# Altium schematic sheet UNG_8088_EVB_LAN9252-SPI_LAN9252-2.SchDoc
size 416 x 264 mm; Revision: A0; SheetNumber: 4; SheetTotal: 4; PageSetup: Record=PageOptions|CenterHorizontal=True|CenterVertical=True|PrintScale=1.02|XCorrection=1.00|YCorrection=1.00|PrintKind=0|BorderSize=5000000|LeftOffset=0|BottomOffset=0|Orientation=2|PaperLength=1000|PaperWidth=1000|Scale=100|PaperSource=15|PrintQuality=-3|MediaType=1|DitherType=10|PrintScaleMode=1|PaperKind=11 x 17|PaperIndex=119; SheetTitle: Change Log; PageTitle: LAN9252-2; ProjName: JUTLAND; DesignDescription: EVB_LAN9252-SPI; Designer: Manikandan; PartNumber: UNG_8088; DocumentFullPathAndName: //depot_np_hweng_boards/ung_hweng/UNG_8088_FDB_LAN9252-ADD-ON-forF28379D/
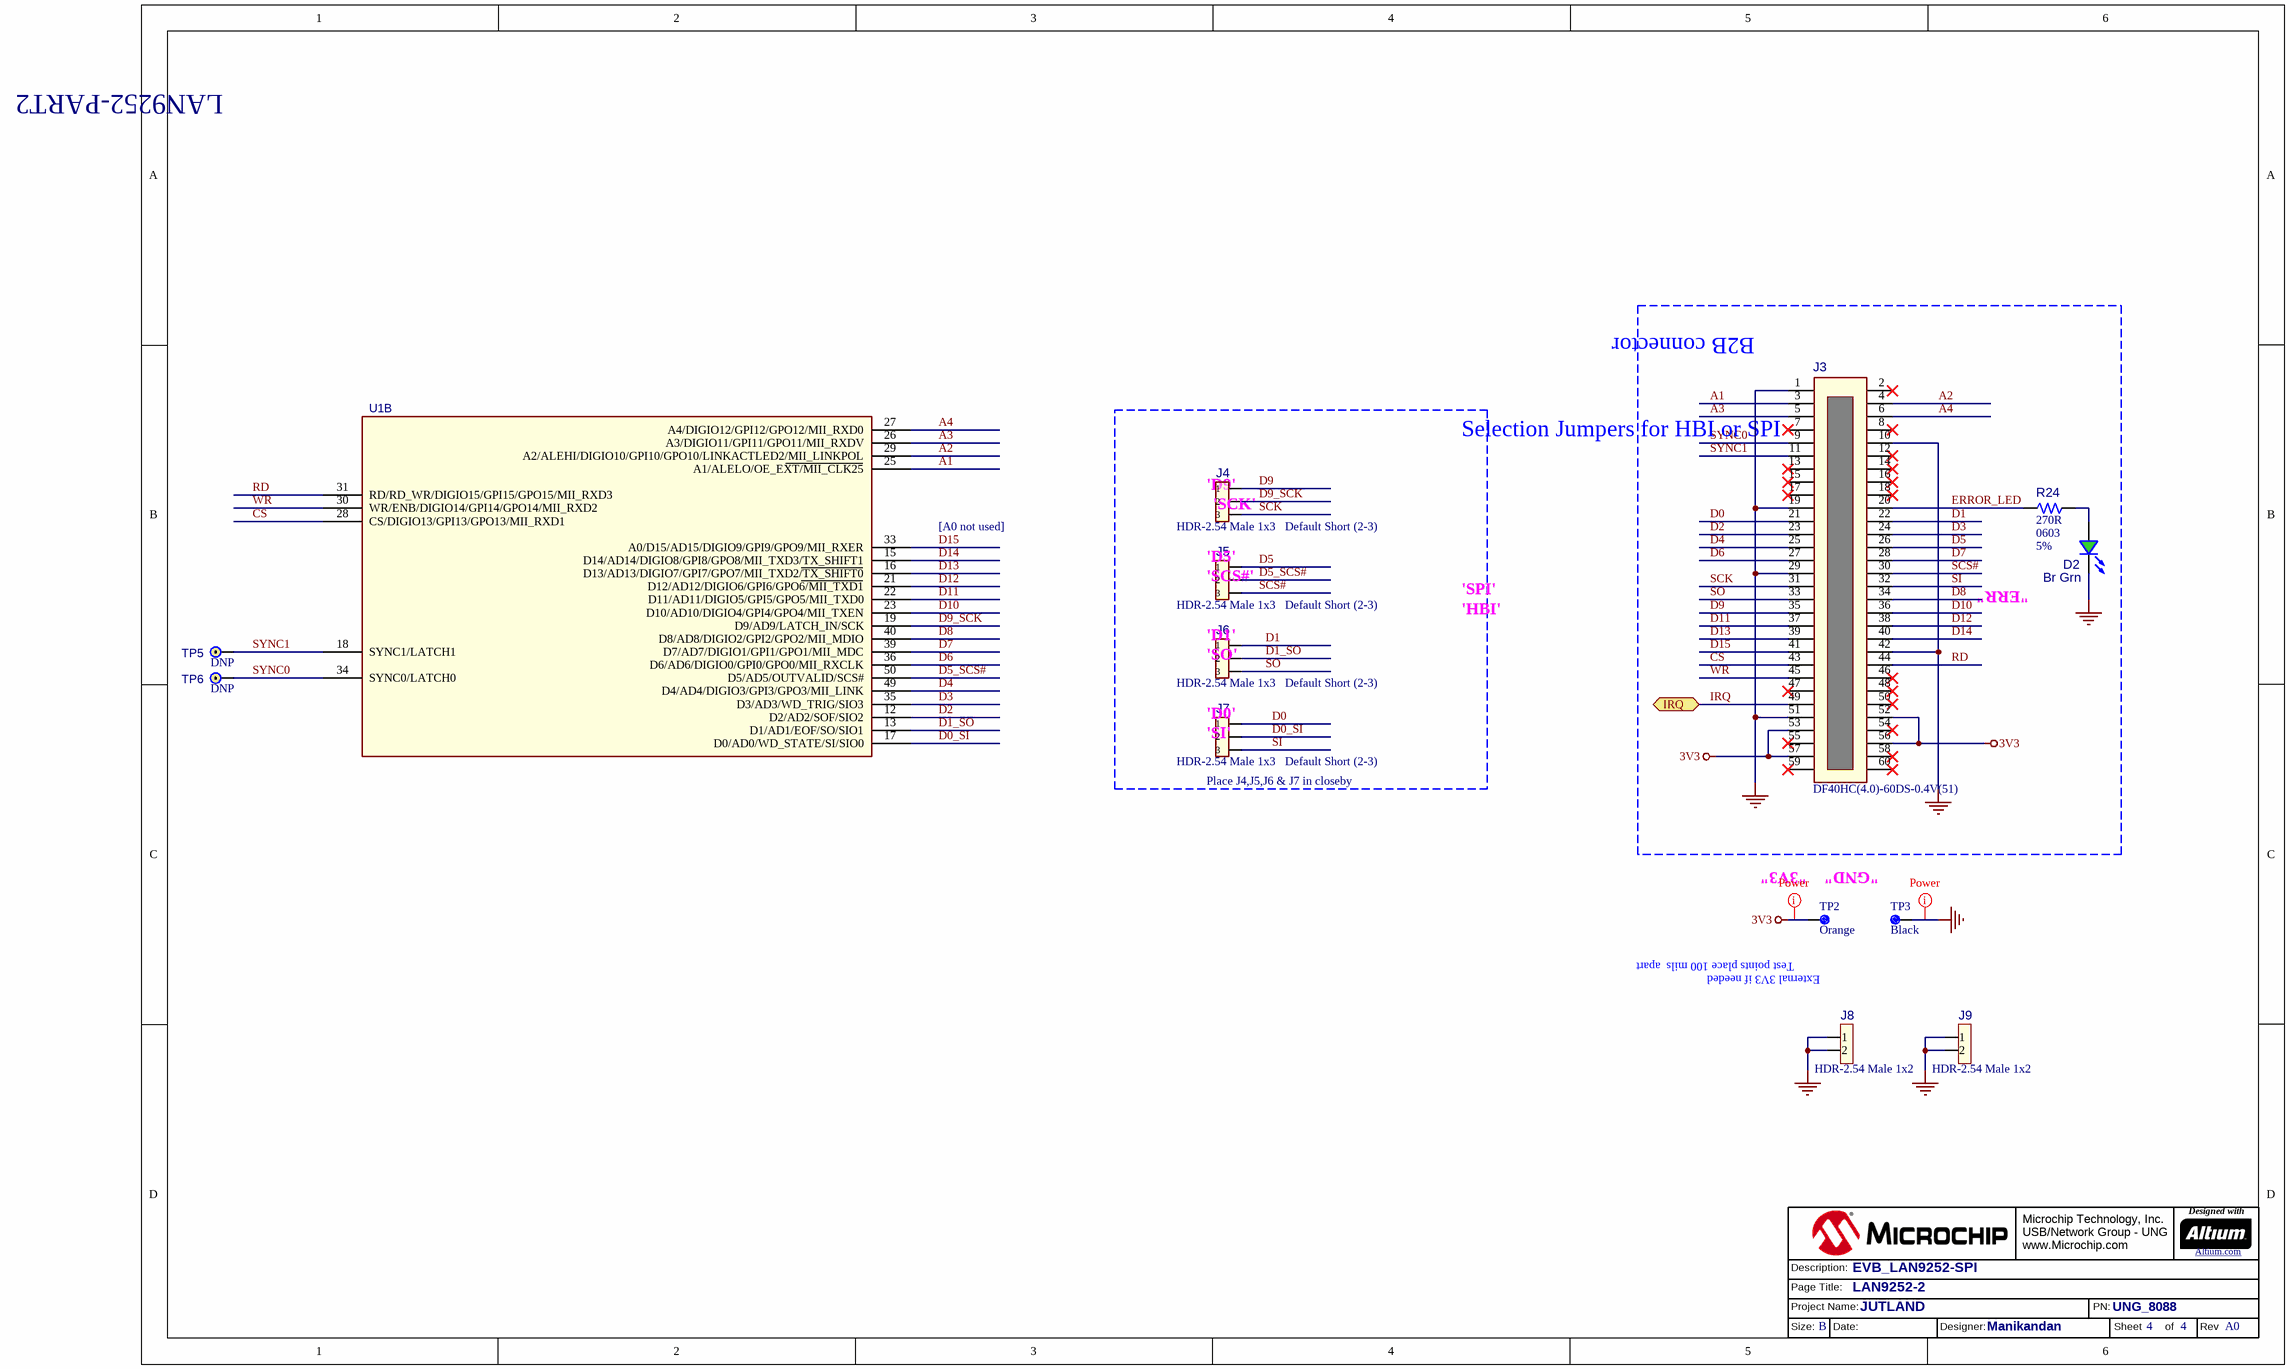
[diagram p0: UNG_8088_EVB_LAN9252-SPI_LAN9252-2.SchDoc]

## Parts
?  (no value)  (graphical)
D2  value Br Grn  [LED_0603_GREEN]  (hidden comment: LED, Bright Green, 0603)
J3  value DF40HC(4.0)-60DS-0.4V(51)  [CONN_DF40HC(4.0)-60DS-0.4V(51)]  (hidden comment: CONN DF40)
J4  value HDR-2.54 Male 1x3  [HDR_M_2.54_1x3]  (hidden comment: Header 1x3)
J5  value HDR-2.54 Male 1x3  [HDR_M_2.54_1x3]  (hidden comment: Header 1x3)
J6  value HDR-2.54 Male 1x3  [HDR_M_2.54_1x3]  (hidden comment: Header 1x3)
J7  value HDR-2.54 Male 1x3  [HDR_M_2.54_1x3]  (hidden comment: Header 1x3)
J8  value HDR-2.54 Male 1x2  [HDR_M_2.54_1x2]  (hidden comment: Header 1x2)
J9  value HDR-2.54 Male 1x2  [HDR_M_2.54_1x2]  (hidden comment: Header 1x2)
R24  value 270R  Package: 0603  Tolerance: 5%  [RES_C_0603]  (hidden comment: Resistor)
TP2  Color: Orange  [CON_TP_TH_V_ORANGE_KEC_5003]  (hidden comment: Mini Orange)
TP3  Color: Black  [CON_TP_TH_V_BLACK_KEC_5001]  (hidden comment: Mini Black)
TP5  Populated: DNP  [TP_PAD51D36]  (hidden comment: Jumper)  (no BOM)
TP6  Populated: DNP  [TP_PAD51D36]  (hidden comment: Jumper)  (no BOM)
U1  (no value)  [QFN-64_9x9_EP6SQ]  (part B of 2)

## Blocks framed on the sheet
B2B connector: D2 J3 R24
Selection Jumpers for HBI or SPI: J4-J7

## Ports
IRQ (bidir)

## Nets
3V3: J3.52(P52) J3.53(P53) J3.56(P56) J3.57(P57) TP2.1
GND: D2.2(K) J3.1(P1) J3.10(P10) J3.19(P19) J3.29(P29) J3.42(P42) J3.51(P51) J8.1 J8.2 J9.1 J9.2 TP3.1
A1: J3.3(P3) U1.25(A1/ALELO/OE_EXT/MII_CLK25)
A2: J3.4(P4) U1.29(A2/ALEHI/DIGIO10/GPI10/GPO10/LINKACTLED2/MII_LINKPOL)
A3: J3.5(P5) U1.26(A3/DIGIO11/GPI11/GPO11/MII_RXDV)
A4: J3.6(P6) U1.27(A4/DIGIO12/GPI12/GPO12/MII_RXD0)
CS: J3.43(P43) U1.28(CS/DIGIO13/GPI13/GPO13/MII_RXD1)
D0: J3.21(P21) J7.1
D0_SI: J7.2 U1.17(D0/AD0/WD_STATE/SI/SIO0)
D1: J3.22(P22) J6.1
D1_SO: J6.2 U1.13(D1/AD1/EOF/SO/SIO1)
D2: J3.23(P23) U1.12(D2/AD2/SOF/SIO2)
D3: J3.24(P24) U1.35(D3/AD3/WD_TRIG/SIO3)
D4: J3.25(P25) U1.49(D4/AD4/DIGIO3/GPI3/GPO3/MII_LINK)
D5: J3.26(P26) J5.1
D5_SCS#: J5.2 U1.50(D5/AD5/OUTVALID/SCS#)
D6: J3.27(P27) U1.36(D6/AD6/DIGIO0/GPI0/GPO0/MII_RXCLK)
D7: J3.28(P28) U1.39(D7/AD7/DIGIO1/GPI1/GPO1/MII_MDC)
D8: J3.34(P34) U1.40(D8/AD8/DIGIO2/GPI2/GPO2/MII_MDIO)
D9: J3.35(P35) J4.1
D9_SCK: J4.2 U1.19(D9/AD9/LATCH_IN/SCK)
D10: J3.36(P36) U1.23(D10/AD10/DIGIO4/GPI4/GPO4/MII_TXEN)
D11: J3.37(P37) U1.22(D11/AD11/DIGIO5/GPI5/GPO5/MII_TXD0)
D12: J3.38(P38) U1.21(D12/AD12/DIGIO6/GPI6/GPO6/MII_TXD1)
D13: J3.39(P39) U1.16(D13/AD13/DIGIO7/GPI7/GPO7/MII_TXD2/TX_SHIFT0)
D14: J3.40(P40) U1.15(D14/AD14/DIGIO8/GPI8/GPO8/MII_TXD3/TX_SHIFT1)
D15: J3.41(P41) U1.33(A0/D15/AD15/DIGIO9/GPI9/GPO9/MII_RXER)
ERROR_LED: J3.20(P20) R24.2
IRQ: J3.49(P49) ; port IRQ
RD: J3.44(P44) U1.31(RD/RD_WR/DIGIO15/GPI15/GPO15/MII_RXD3)
SCK: J3.31(P31) J4.3
SCS#: J3.30(P30) J5.3
SI: J3.32(P32) J7.3
SO: J3.33(P33) J6.3
SYNC0: J3.9(P9) TP6.1(P1) U1.34(SYNC0/LATCH0)
SYNC1: J3.11(P11) TP5.1(P1) U1.18(SYNC1/LATCH1)
WR: J3.45(P45) U1.30(WR/ENB/DIGIO14/GPI14/GPO14/MII_RXD2)
NetD2_1: D2.1(A) R24.1

Not connected (* = marked no-connect by the designer): J3 2(P2)* 7(P7)* 8(P8)* 12(P12)* 13(P13)* 14(P14)* 15(P15)* 16(P16)* 17(P17)* 18(P18)* 46(P46)* 47(P47)* 48(P48)* 50(P50)* 54(P54)* 55(P55)* 58(P58)* 59(P59)* 60(P60)*

## Layout directives
mark named Power: 3V3, GND

## Notes on the sheet
- LAN9252-PART2
- [A0 not used]
- (near J4) 'D9'
- (near J4) 'SCK'
- Default Short (2-3)
- (near J5) 'D5'
- (near J5) 'SCS#'
- 'SPI'
- (near D2) "ERR"
- (near J6) 'D1'
- (near J6) 'SO'
- 'HBI'
- (near J7) 'D0'
- (near J7) 'SI'
- (near J7) Place J4,J5,J6 & J7 in closeby
- (near TP2) "3V3"
- (near TP3) "GND"
- Test points place 100 mils  apart
- External 3V3 if needed
- Microchip Technology, Inc.
  USB/Network Group - UNG
  www.Microchip.com
- Designed with
- Altium.com <http://go.altium.com/MicrochipLandingPage_Evaluation.html>
- Page Title:
- Project Name:
- Description:
- PN:
- Size:
- B
- Date:
- Designer:
- Sheet
- of
- Rev

## Library data of the parts
? = Title Block B_UNG1_Altium
D2 = LED, Bright Green, 0603: Manufacturer 1: Lite-On; Manufacturer Part Number 1: LTST-C191KGKT; Type: LED Single; Forward Current: 20mA; MCD: 35mcd; Owner: Jennifer Hancock; Viewing Angle: 130°; Revision: -; Description_: LED, Bright Green, 0603; Package: 0603 (1608 Metric); ComponentLink1URL: http://optoelectronics.liteon.com/upload/download/DS22-2000-228/S_110_LTST-C191KGKT.pdf; ComponentLink1Description: Datasheet; Category: Diode; Mounting Type: Surface Mount; Supplier 1: Digi-Key; Supplier Part Number 1: 160-1446-6-ND
J3 = CONN RCPT 60P 4MM DF40 HRS: Manufacturer 1: Hirose Electric Co Ltd; Owner: Manikandan; Populated: YES; Description_: CONN RCPT 60P 4MM DF40 HRS; ComponentLink1URL: http://nyusperforce.smsc.com//depot_np_hweng_boards/altium_libraries/datasheets/Hirose\DF40HC(4.0)-60DS-0.4V(51).pdf; ComponentLink1Description: Datasheet; Package: 60pin 2 Row; Type: Connector; Category: Interconnects; Manufacturer Part Number 1: DF40HC(4.0)-60DS-0.4V(51); Supplier 1: Digi-Key; Supplier Part Number 1: H11918CT-ND
J4-J7 = CON0465: Manufacturer 1: Samtec; Manufacturer Part Number 1: TSW-103-07-T-S; Description_: CON HDR-2.54 Male 1x3 Tin 5.84MH TH VERT; Populated: Yes; MCHP-ID: CON0465; Revision: 1; Status: Production; ComponentLink1URL: https://chn-vm-apps.microchip.com/mchprepo/parts/Datasheets/TSW-XXX-XX-XXX-X-XX-XXX-MKT.pdf; ComponentLink1Description: Datasheet; Type: Header 2.54mm; Category: Connector; Supplier 1: Digi-Key; Supplier Part Number 1: SAM1035-03-ND; Quantity Override: 1
J8 J9 = CON1312: Manufacturer 1: Sullins Connector Solutions; Manufacturer Part Number 1: PREC002SAAN-RC; Description_: CON HDR-2.54 Male 1x2 Tin 5.84MH TH VERT; Owner: Randolph Sobrepena; Populated: YES; MCHP-ID: CON1312; Revision: 2; Status: Production; ComponentLink1URL: https://chn-vm-apps.microchip.com/mchprepo/parts/Datasheets/z RzCzzzSzzN-RC, ST,11635-B.pdf; ComponentLink1Description: Datasheet; Type: Header 2.54mm; Category: Connector; Supplier 1: Digi-Key; Supplier Part Number 1: S1012EC-02-ND; Quantity Override: 1
R24 = RES1150: Manufacturer 1: Panasonic; Manufacturer Part Number 1: ERJ-3GEYJ271V; Description_: RES TKF 270R 5% 1/10W SMD 0603; Dev Tools Status: Production; Voltage: 75V; Temperature Coeffcient: 200ppm/C; Power: 1/10W; Owner: Bogdan P (M91398); Populated: Yes; MCHP-ID: RES1150; Revision: 0; Status: MCL Design; ComponentLink1URL: https://chn-vm-apps.microchip.com/mchprepo/parts/Datasheets/AOA0000CE1.pdf; ComponentLink1Description: Datasheet; Operating Temperature: -55C to +155C; Category: Resistor; Type: RES SMD; Composition: TKF; Supplier 1: Digi-Key; Supplier Part Number 1: P270GCT-ND; Quantity Override: 1
TP2 = TP 66R42 ORN: TEST POINT PC MINI .040"D ORANGE; Manufacturer 1: Keystone Electronics; Manufacturer Part Number 1: 5003; Populated: Yes; Supplier 1: Digi-Key; RoHS: RoHS Compliant; Category: Test and Measurement; Stock 1: 88091; Pricing 1: 1=0.35, 10=0.327, 50=0.238, 100=0.2286, 250=0.20528, 500=0.19594, 1000=0.16328, 2500=0.14928, 5000=0.13995 (USD); Packaging: Bulk; Type: PC Test Point, Miniature; Mounting Type: 0.040" (1.02mm) Hole Diameter; Description_: TEST POINT PC MINI .040"D ORANGE; ComponentLink1URL: http://www.keyelco.com/product-pdf.cfm?p=1312; ComponentLink1Description: http://www.keyelco.com/product-pdf.cfm?p=1312; Supplier Part Number 1: 5003K-ND
TP3 = TP 66R42 BLK: TEST POINT PC MINI .040"D BLACK; Manufacturer 1: Keystone Electronics; Manufacturer Part Number 1: 5001; Populated: Yes; Supplier 1: Digi-Key; RoHS: RoHS Compliant; Category: Test and Measurement; Stock 1: 88091; Pricing 1: 1=0.35, 10=0.327, 50=0.238, 100=0.2286, 250=0.20528, 500=0.19594, 1000=0.16328, 2500=0.14928, 5000=0.13995 (USD); Packaging: Bulk; Type: PC Test Point, Miniature; Terminal: 0.010" x 0.020" (0.25mm x 0.51mm) Phosphor Bronze Wire, Silver Plated; Description_: TEST POINT PC MINI .040"D BLACK; ComponentLink1URL: http://www.keyelco.com/product-pdf.cfm?p=1310; ComponentLink1Description: http://www.keyelco.com/product-pdf.cfm?p=1310; Supplier Part Number 1: 5001K-ND
TP5 TP6 = TEST PAD TH 51X36: Manufacturer Part Number: none; Description_: TEST Pad, PIN sized, 51pad, 36 FHS; Manufacturer: none; Category: Non BOM Item; Type: Male; Mounting Type: Through Hole; Supplier 1: none; Supplier Part Number 1: none
U1 = LAN9252_QFN64: IC, 2/3-Port EtherCAT® Slave Controller, QFN64; Manufacturer Part Number 1: LAN9252x/ML; Manufacturer 1: Microchip; Populated: Yes; Owner: Manikandan; Supplier Part Number 1: LAN9252I/ML-ND; Supplier 1: Digikey; Description_: IC, 2/3-Port EtherCAT® Slave Controller, QFN64; RoHS: Yes; Package: QFN64-9X9x1; Document Link: http://ww1.microchip.com/downloads/en/DeviceDoc/00001909A.pdf; Status: New